# EAGLE schematic ParaquedasV2 (EAGLE 9.6.2)
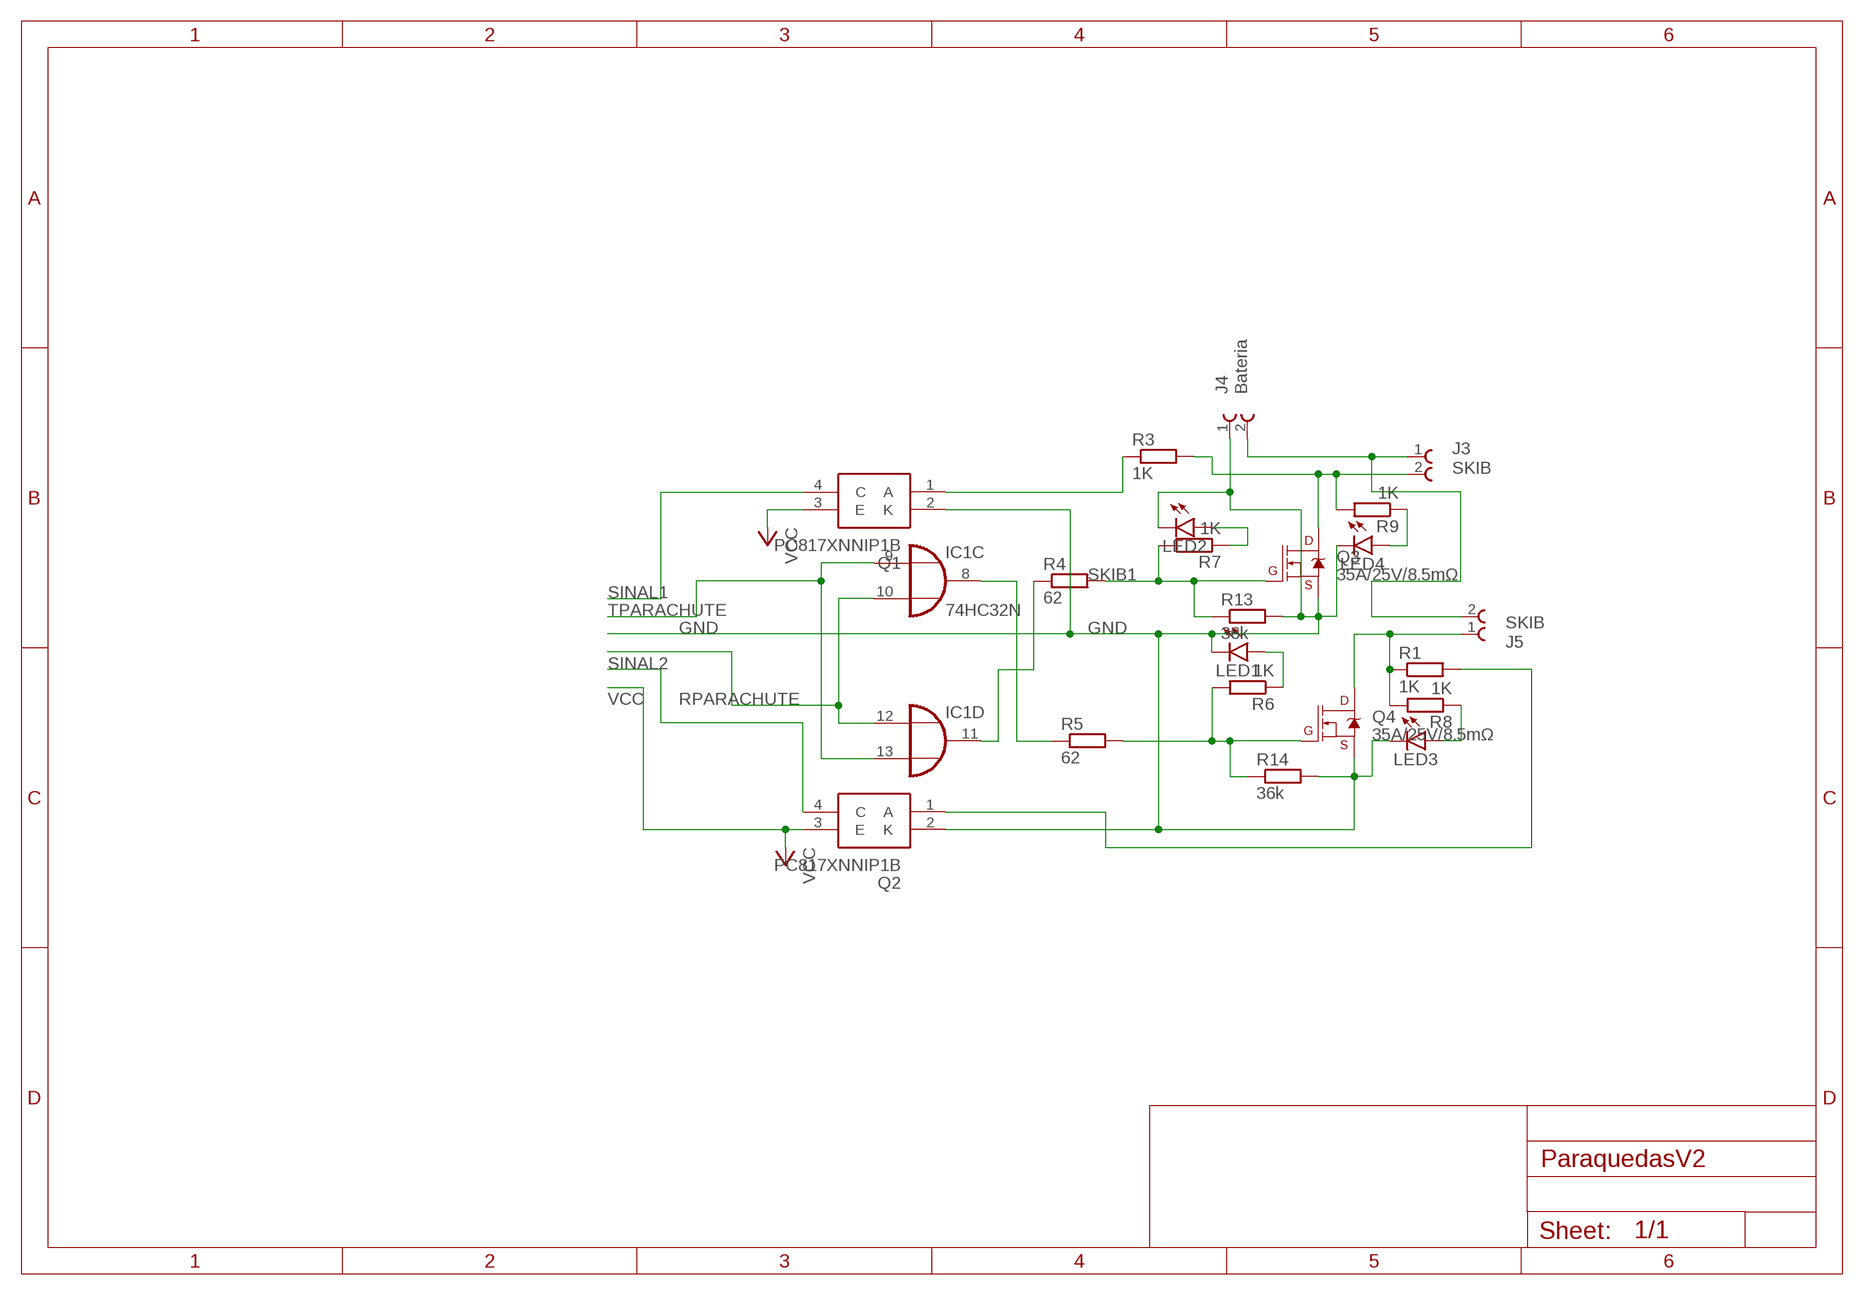
[diagram p0: schematic, sheet 1]

## Parts
IC1  74HC32N  [DIL14]
J3  SKIB  691111710002  [691111710002]
J4  Bateria  691111710002  [691111710002]
J5  SKIB  691111710002  [691111710002]
LED1  LEDCHIP-LED0805  [CHIP-LED0805]
LED2  LEDCHIP-LED0805  [CHIP-LED0805]
LED3  LEDCHIP-LED0805  [CHIP-LED0805]
LED4  LEDCHIP-LED0805  [CHIP-LED0805]
Q1  PC817XNNIP1B  [SOP254P960X420-4N]
Q2  PC817XNNIP1B  [SOP254P960X420-4N]
Q3  35A/25V/8.5mΩ  MOSFET-NCH-FDD8780  [TO-252/DPAK]
Q4  35A/25V/8.5mΩ  MOSFET-NCH-FDD8780  [TO-252/DPAK]
R1  1K  R-EU_R0603  [R0603]
R3  1K  R-EU_R0603  [R0603]
R4  62  R-EU_M0805  [M0805]
R5  62  R-EU_M0805  [M0805]
R6  1K  R-EU_M0805  [M0805]
R7  1K  R-EU_M0805  [M0805]
R8  1K  R-EU_M0805  [M0805]
R9  1K  R-EU_M0805  [M0805]
R13  36k  R-EU_M0805  [M0805]
R14  36k  R-EU_M0805  [M0805]

## Nets
GND: J4.1 LED1.C LED2.C LED3.C LED4.C Q1.2(K) Q2.2(K) Q3.3(S) Q4.3(S) R13.2 R14.2
N$6: IC1.8(C:O) R5.1
N$7: IC1.11(D:O) R4.1
N$17: Q1.1(A) R3.1
N$19: LED4.A R9.1
N$20: Q2.1(A) R1.2
N$21: J3.1 J4.2 J5.2
N$22: LED2.A R7.1
N$23: LED1.A R6.1
N$24: LED3.A R8.1
N$25: J5.1 Q4.2(D) R1.1 R8.2
N$29: J3.2 Q3.2(D) R3.2 R9.2
RPARACHUTE: IC1.10(C:I1) IC1.12(D:I0)
SINAL1: Q1.4(C)
SINAL2: Q2.4(C)
SKIB1: Q3.1(G) R4.2 R7.2 R13.1
SKIB2: Q4.1(G) R5.2 R6.2 R14.1
TPARACHUTE: IC1.9(C:I0) IC1.13(D:I1)
VCC: Q1.3(E) Q2.3(E)
Unconnected: IC1.1(A:I0) IC1.2(A:I1) IC1.3(A:O) IC1.4(B:I0) IC1.5(B:I1) IC1.6(B:O)

## Power pins joined to a net without a drawn wire
GND: IC1.7(P:GND)
VCC: IC1.14(P:VCC)

## Library data of the parts
IC1 = 74xx-eu:74*32: Quad 2-input OR gate
J3-J5 = 691111710002:691111710002: WR-TBL Serie 111 - 5.0mm Horizontal Entry Modular With Pressure Clamp - 2.0mm2 Wires, 2 Pins=>Code : Con_TBL_Screw_PressureClamp_691111710002 <http://katalog.we-online.de/media/images/eican/Con_TBL_Screw_PressureClamp_6911117100xx_pf2.jpg> Details see: http://katalog.we-online.de/en/em/691_111_710_0xx Created 2014-06-17, Karrer Zheng 2014 (C) Würth Elektronik Check availability <https://pricing.snapeda.com/parts/691111710002/Wurth%20Electronics/view-part?ref=eda>; AVAILABILITY: In Stock; DESCRIPTION: 2 Position Wire to Board Terminal Block Horizontal with Board 0.197 (5.00mm) Through Hole; MF: Wurth Electronics; MP: 691111710002; PACKAGE: None; PRICE: None; PURCHASE-URL: https://pricing.snapeda.com/search/part/691111710002/?ref=eda
LED1-LED4 = led:LED: LED OSRAM: - CHIPLED LG R971, LG N971, LY N971, LG Q971, LY Q971, LO R971, LY R971 LH N974, LH R974 LS Q976, LO Q976, LY Q976 LO Q996 - Hyper CHIPLED LW Q18S LB Q993, LB Q99A, LB R99A - SideLED LS A670, LO A670, LY A670, LG A670, LP A670 LB A673, LV A673, LT A673, LW A673 LH A674 LY A675 LS A676, LA A676, LO A676, LY A676, LW A676 LS A679, LY A679, LG A679 - Hyper Micro SIDELED® LS Y876, LA Y876, LO Y876, LY Y876 LT Y87S - SmartLED LW L88C, LW L88S LB L89C, LB L89S, LG L890 LS L89K, LO L89K, LY L89K LS L896, LA L896, LO L896, LY L896 - TOPLED LS T670, LO T670, LY T670, LG T670, LP T670 LSG T670, LSP T670, LSY T670, LOP T670, LYG T670 LG T671, LOG T671, LSG T671 LB T673, LV T673, LT T673, LW T673 LH T674 LS T676, LA T676, LO T676, LY T676, LB T676, LH T676, LSB T676, LW T676 LB T67C, LV T67C, LT T67C, LS T67K, LO T67K, LY T67K, LW E67C LS E67B, LA E67B, LO E67B, LY E67B, LB E67C, LV E67C, LT E67C LW T67C LS T679, LY T679, LG T679 LS T770, LO T770, LY T770, LG T770, LP T770 LB T773, LV T773, LT T773, LW T773 LH T774 LS E675, LA E675, LY E675, LS T675 LS T776, LA T776, LO T776, LY T776, LB T776 LHGB T686 LT T68C, LB T68C - Hyper Mini TOPLED® LB M676 - Mini TOPLED Santana® LG M470 LS M47K, LO M47K, LY M47K Source: http://www.osram.convergy.de LUXEON: - LUMILED® LXK2-PW12-R00, LXK2-PW12-S00, LXK2-PW14-U00, LXK2-PW14-V00 LXK2-PM12-R00, LXK2-PM12-S00, LXK2-PM14-U00 LXK2-PE12-Q00, LXK2-PE12-R00, LXK2-PE12-S00, LXK2-PE14-T00, LXK2-PE14-U00 LXK2-PB12-K00, LXK2-PB12-L00, LXK2-PB12-M00, LXK2-PB14-N00, LXK2-PB14-P00, LXK2-PB14-Q00 LXK2-PR12-L00, LXK2-PR12-M00, LXK2-PR14-Q00, LXK2-PR14-R00 LXK2-PD12-Q00, LXK2-PD12-R00, LXK2-PD12-S00 LXK2-PH12-R00, LXK2-PH12-S00 LXK2-PL12-P00, LXK2-PL12-Q00, LXK2-PL12-R00 Source: www.luxeon.com KINGBRIGHT: KA-3528ASYC Source: www.kingbright.com
Q1 Q2 = SamacSys_Parts:PC817XNNIP1B: Transistor Output Optocouplers Photocoupler Source: Datasheet; DESCRIPTION: Transistor Output Optocouplers Photocoupler; HEIGHT: 4.2mm; MANUFACTURER_NAME: Sharp Microelectronics; MANUFACTURER_PART_NUMBER: PC817XNNIP1B; MOUSER_PART_NUMBER: 852-PC817XNNIP1B; MOUSER_PRICE-STOCK: https://www.mouser.co.uk/ProductDetail/Sharp-Microelectronics/PC817XNNIP1B?qs=rrS6PyfT74dJvnx7366b6Q%3D%3D
Q3 Q4 = SparkFun-DiscreteSemi:MOSFET-NCH: N-channel MOSFETs Voltage controlled devices that allow control of high current outputs. SparkFun Products: SparkFun OpenScale <https://www.sparkfun.com/products/13261> SparkFun Digital Sandbox <https://www.sparkfun.com/products/12651> SparkFun Monster Moto Shield <https://www.sparkfun.com/products/10182> SparkFun MOSFET Power Controller <https://www.sparkfun.com/products/11214>; PROD_ID: TRANS-09984
R1 R3-R9 R13 R14 = rcl:R-EU_: RESISTOR, European symbol; SPICEPREFIX: R